# EAGLE schematic brick_serial_bluetooth_RN42 (EAGLE 7.3.0)
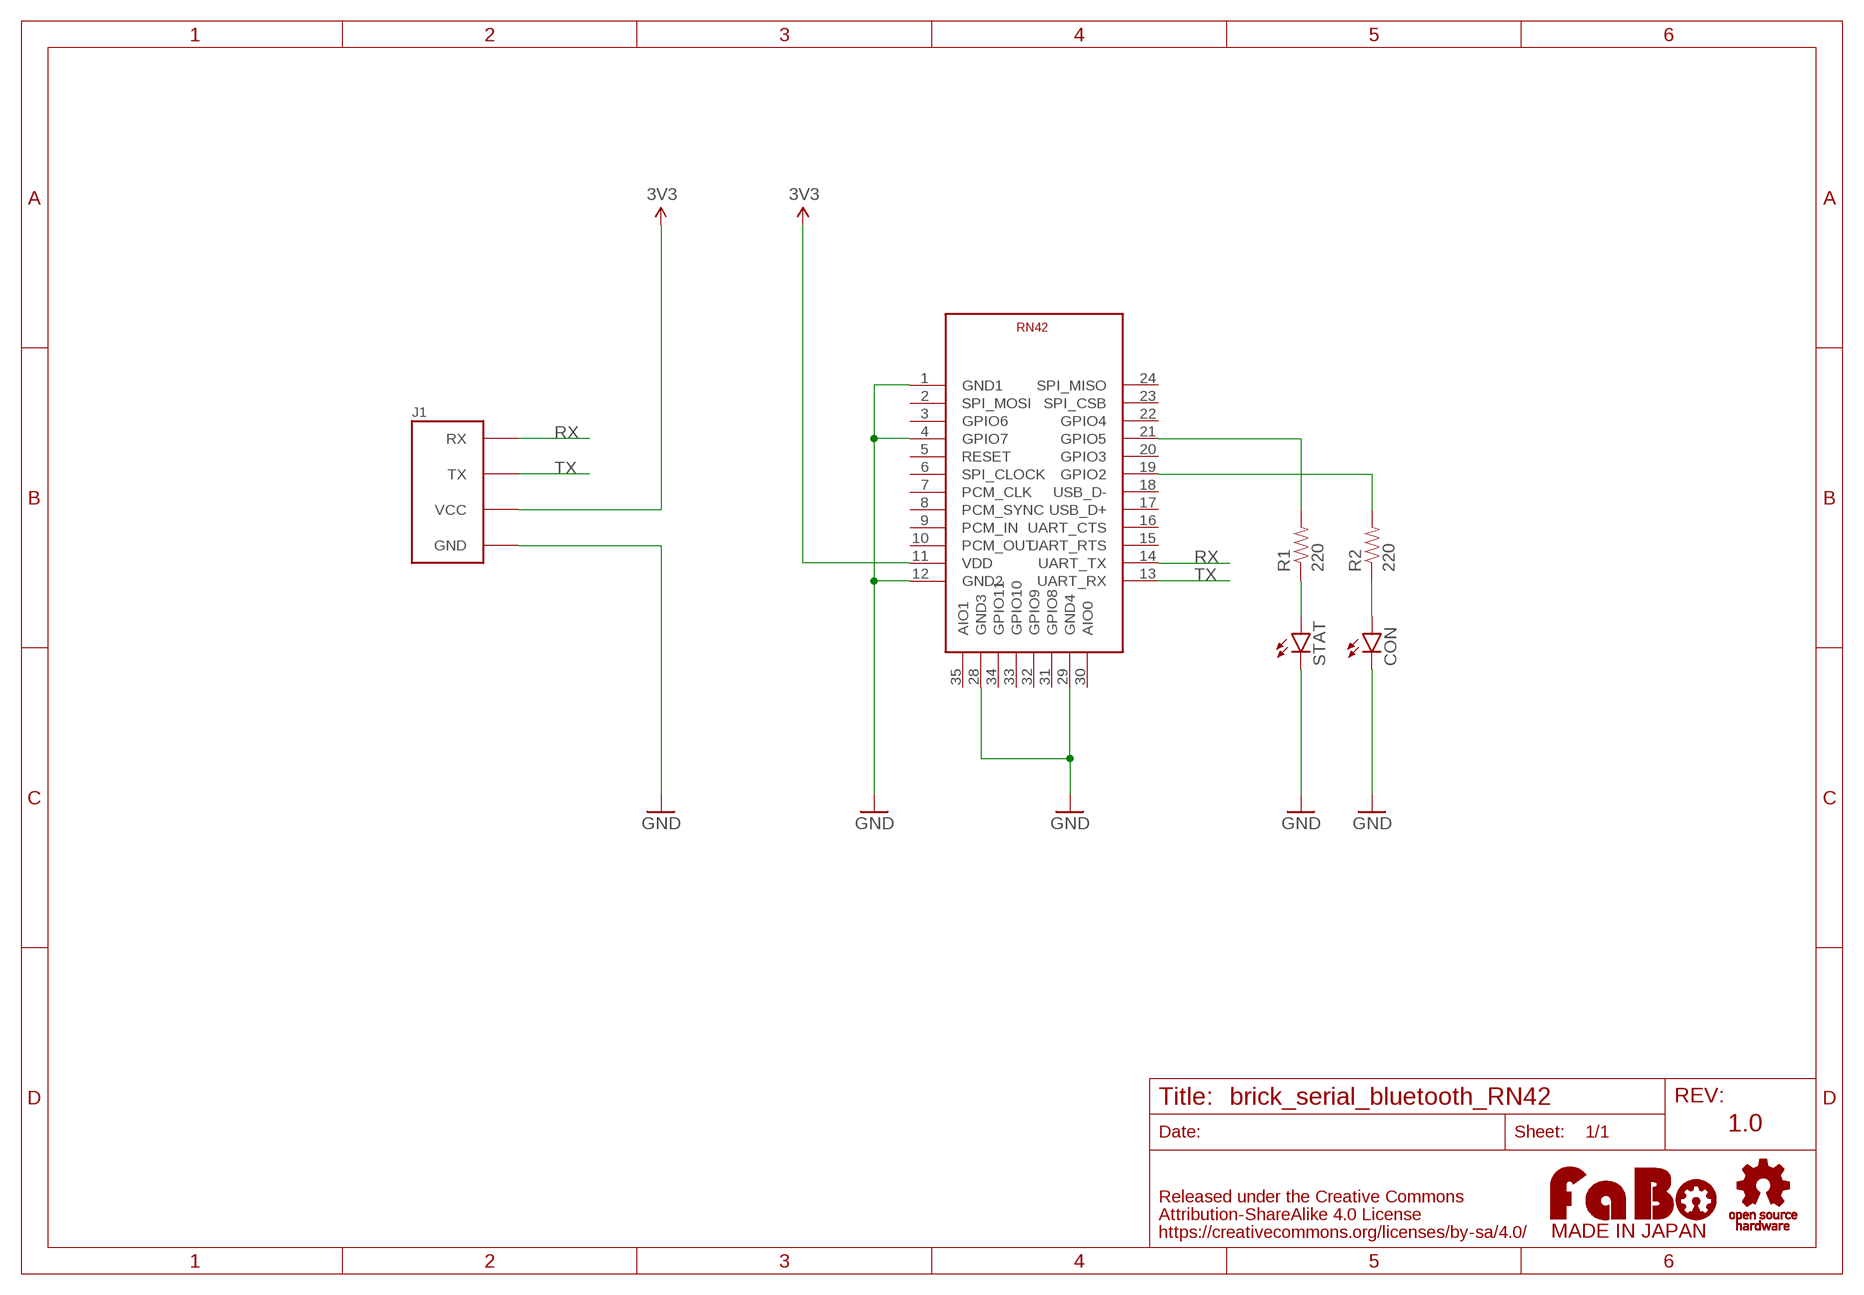
[diagram p0: schematic, sheet 1]

## Parts
CON  LED-EIA0603  [EIA0603-LED]
J1  FABO_BRICK_SERIAL  [FABO_BRICK_SERIAL]
R1  220  RES-EIA0603  [EIA0603]
R2  220  RES-EIA0603  [EIA0603]
STAT  LED-EIA0603  [EIA0603-LED]
U$1  MICROCHIP-RN42  [MICROCHIP-RN42]
U$3  LOGO_FABO-M  [LOGO_FABO_M]
U$4  LOGO_OSHW-T_M  [LOGO_OSHW_T_M]

## Nets
3V3: J1.VCC U$1.11(VDD)
GND: CON.C J1.GND STAT.C U$1.1(GND1) U$1.4(GPIO7) U$1.12(GND2) U$1.28(GND3) U$1.29(GND4)
N$1: R1.1 STAT.A
N$2: R2.2 U$1.19(GPIO2)
N$3: R1.2 U$1.21(GPIO5)
N$4: CON.A R2.1
RX: J1.RX U$1.14(UART_TX)
TX: J1.TX U$1.13(UART_RX)
Unconnected: U$1.2(SPI_MOSI) U$1.3(GPIO6) U$1.5(RESET) U$1.6(SPI_CLOCK) U$1.7(PCM_CLK) U$1.8(PCM_SYNC) U$1.9(PCM_IN) U$1.10(PCM_OUT) U$1.15(UART_RTS) U$1.16(UART_CTS) U$1.17(USB_D+) U$1.18(USB_D-) U$1.20(GPIO3) U$1.22(GPIO4) U$1.23(SPI_CSB) U$1.24(SPI_MISO) U$1.30(AIO0) U$1.31(GPIO8) U$1.32(GPIO9) U$1.33(GPIO10) U$1.34(GPIO11) U$1.35(AIO1)

## Notes on the sheet
- 1.0

## Library data of the parts
CON STAT = FaBo-etc:LED: LED
J1 = FaBo-Template:FABO_BRICK_SERIAL: FaBo Brick Serial
R1 R2 = FaBo-etc:RES
U$1 = FaBo-BT:MICROCHIP-RN42
U$3 = FaBo-etc:LOGO_FABO
U$4 = FaBo-etc:LOGO_OSHW

## Net classes
0 default: clearance 0.254 mm